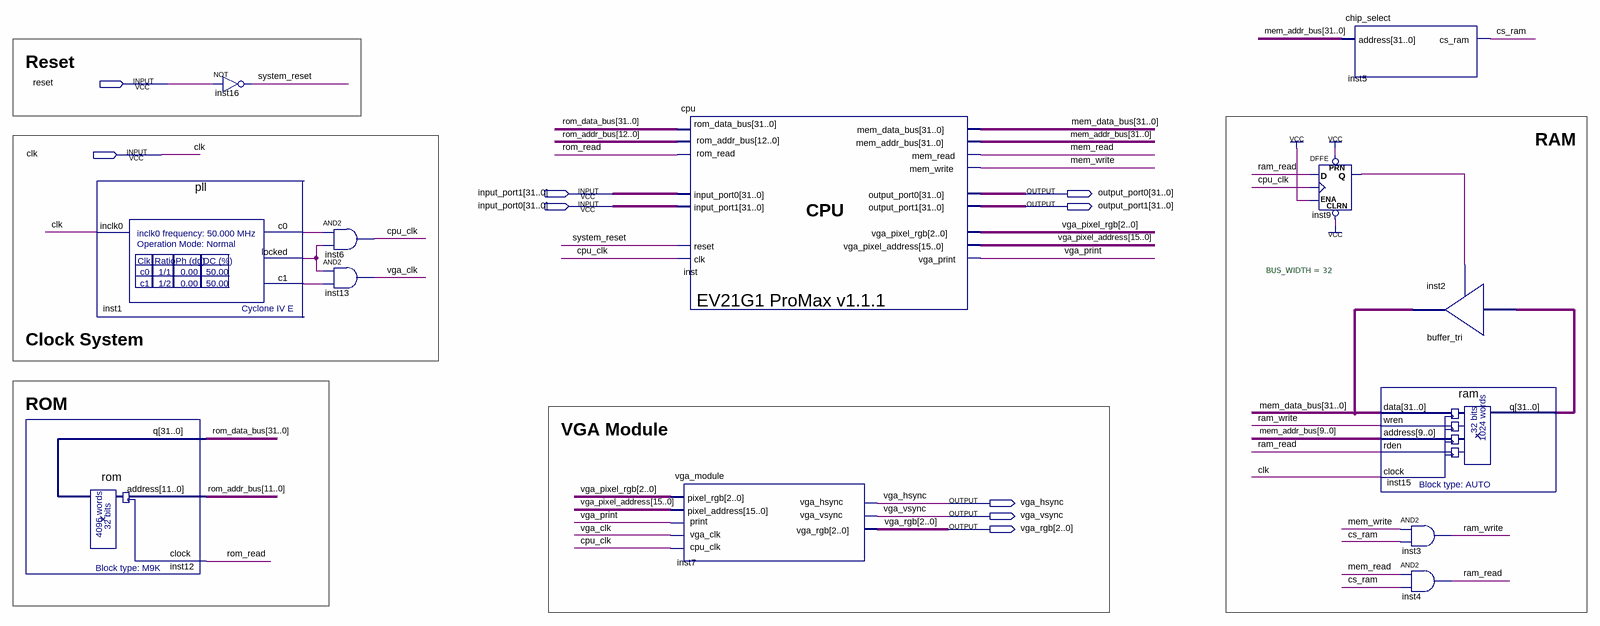
[diagram p0: schematic sheet]
// Quartus schematic ev21g1.bdf as structural Verilog: 13 symbols, 9 pins
module ev21g1 (
  input  reset,
  input  clk,
  input  [31:0] input_port1,
  input  [31:0] input_port0,
  output [31:0] output_port0,
  output [31:0] output_port1,
  output vga_hsync,
  output vga_vsync,
  output [2:0] vga_rgb
);

  wire cpu_clk, cs_ram, inst1_c0, inst1_c1, inst1_locked, inst9_q, mem_read, mem_write, ram_read, ram_write,
       rom_read, system_reset, vga_clk, vga_print;
  wire [2:0] vga_pixel_rgb;
  wire [12:0] rom_addr_bus;
  wire [15:0] vga_pixel_address;
  wire [31:0] inst15_q, mem_addr_bus, mem_data_bus, rom_data_bus;

  rom inst12 (.address(rom_addr_bus[11:0]), .clock(rom_read), .q(rom_data_bus));
  pll inst1 (.inclk0(clk), .c0(inst1_c0), .c1(inst1_c1), .locked(inst1_locked));
  not inst16 (system_reset, reset);
  and inst6 (cpu_clk, inst1_c0, inst1_locked);
  and inst13 (vga_clk, inst1_locked, inst1_c1);
  vga_module inst7 (
    .pixel_rgb(vga_pixel_rgb), .pixel_address(vga_pixel_address), .print(vga_print), .vga_clk(vga_clk),
    .cpu_clk(cpu_clk), .vga_rgb(vga_rgb), .vga_hsync(vga_hsync), .vga_vsync(vga_vsync));
  cpu inst (
    .rom_data_bus(rom_data_bus), .clk(cpu_clk), .reset(system_reset), .input_port0(input_port1),
    .input_port1(input_port0), .rom_addr_bus(rom_addr_bus), .rom_read(rom_read), .output_port0(output_port0),
    .output_port1(output_port1), .mem_read(mem_read), .mem_write(mem_write), .mem_addr_bus(mem_addr_bus),
    .vga_pixel_rgb(vga_pixel_rgb), .vga_pixel_address(vga_pixel_address), .vga_print(vga_print),
    .mem_data_bus(mem_data_bus));
  chip_select inst5 (.address(mem_addr_bus), .cs_ram(cs_ram));
  DFFE inst9 (.PRN(1'b1), .CLRN(1'b1), .D(ram_read), .CLK(cpu_clk), .ENA(1'b1), .Q(inst9_q));
  ram inst15 (
    .data(mem_data_bus), .wren(ram_write), .address(mem_addr_bus[9:0]), .rden(ram_read), .clock(clk),
    .q(inst15_q));
  buffer_tri #(.BUS_WIDTH(32)) inst2 (.in(inst15_q), .en(inst9_q), .out(mem_data_bus));
  and inst3 (ram_write, mem_write, cs_ram);
  and inst4 (ram_read, mem_read, cs_ram);

  // Notes on the sheet:
  //   Reset
  //   RAM
  //   Clock System
  //   ROM
  //   VGA Module
endmodule
